# Altium schematic sheet Sheet1.SchDoc
size 420 x 297 mm; PageSetup: Record=PageOptions|CenterHorizontal=True|CenterVertical=True|PrintScale=1.00|XCorrection=1.00|YCorrection=1.00|PrintKind=1|BorderSize=5000000|LeftOffset=0|BottomOffset=0|Orientation=2|PaperLength=1000|PaperWidth=1000|Scale=100|PaperSource=15|PrintQuality=1200|MediaType=1|DitherType=10|PaperKind=A3|PrintScaleMode=1; Weight: -; ScaleFactor: -; NormInspection: Норм.Контр.; Name_1: Тележка с СЭС; Prepod: Лавров А.В.; Group: Группа ИУ4-83Б; Scale: 1:1; DocumentType: Схема электрическая принципиальная; FirstReferrence: АБВГ.123456.001; Number_kur: ИУ4.11.03.03.23.83.001 Э3
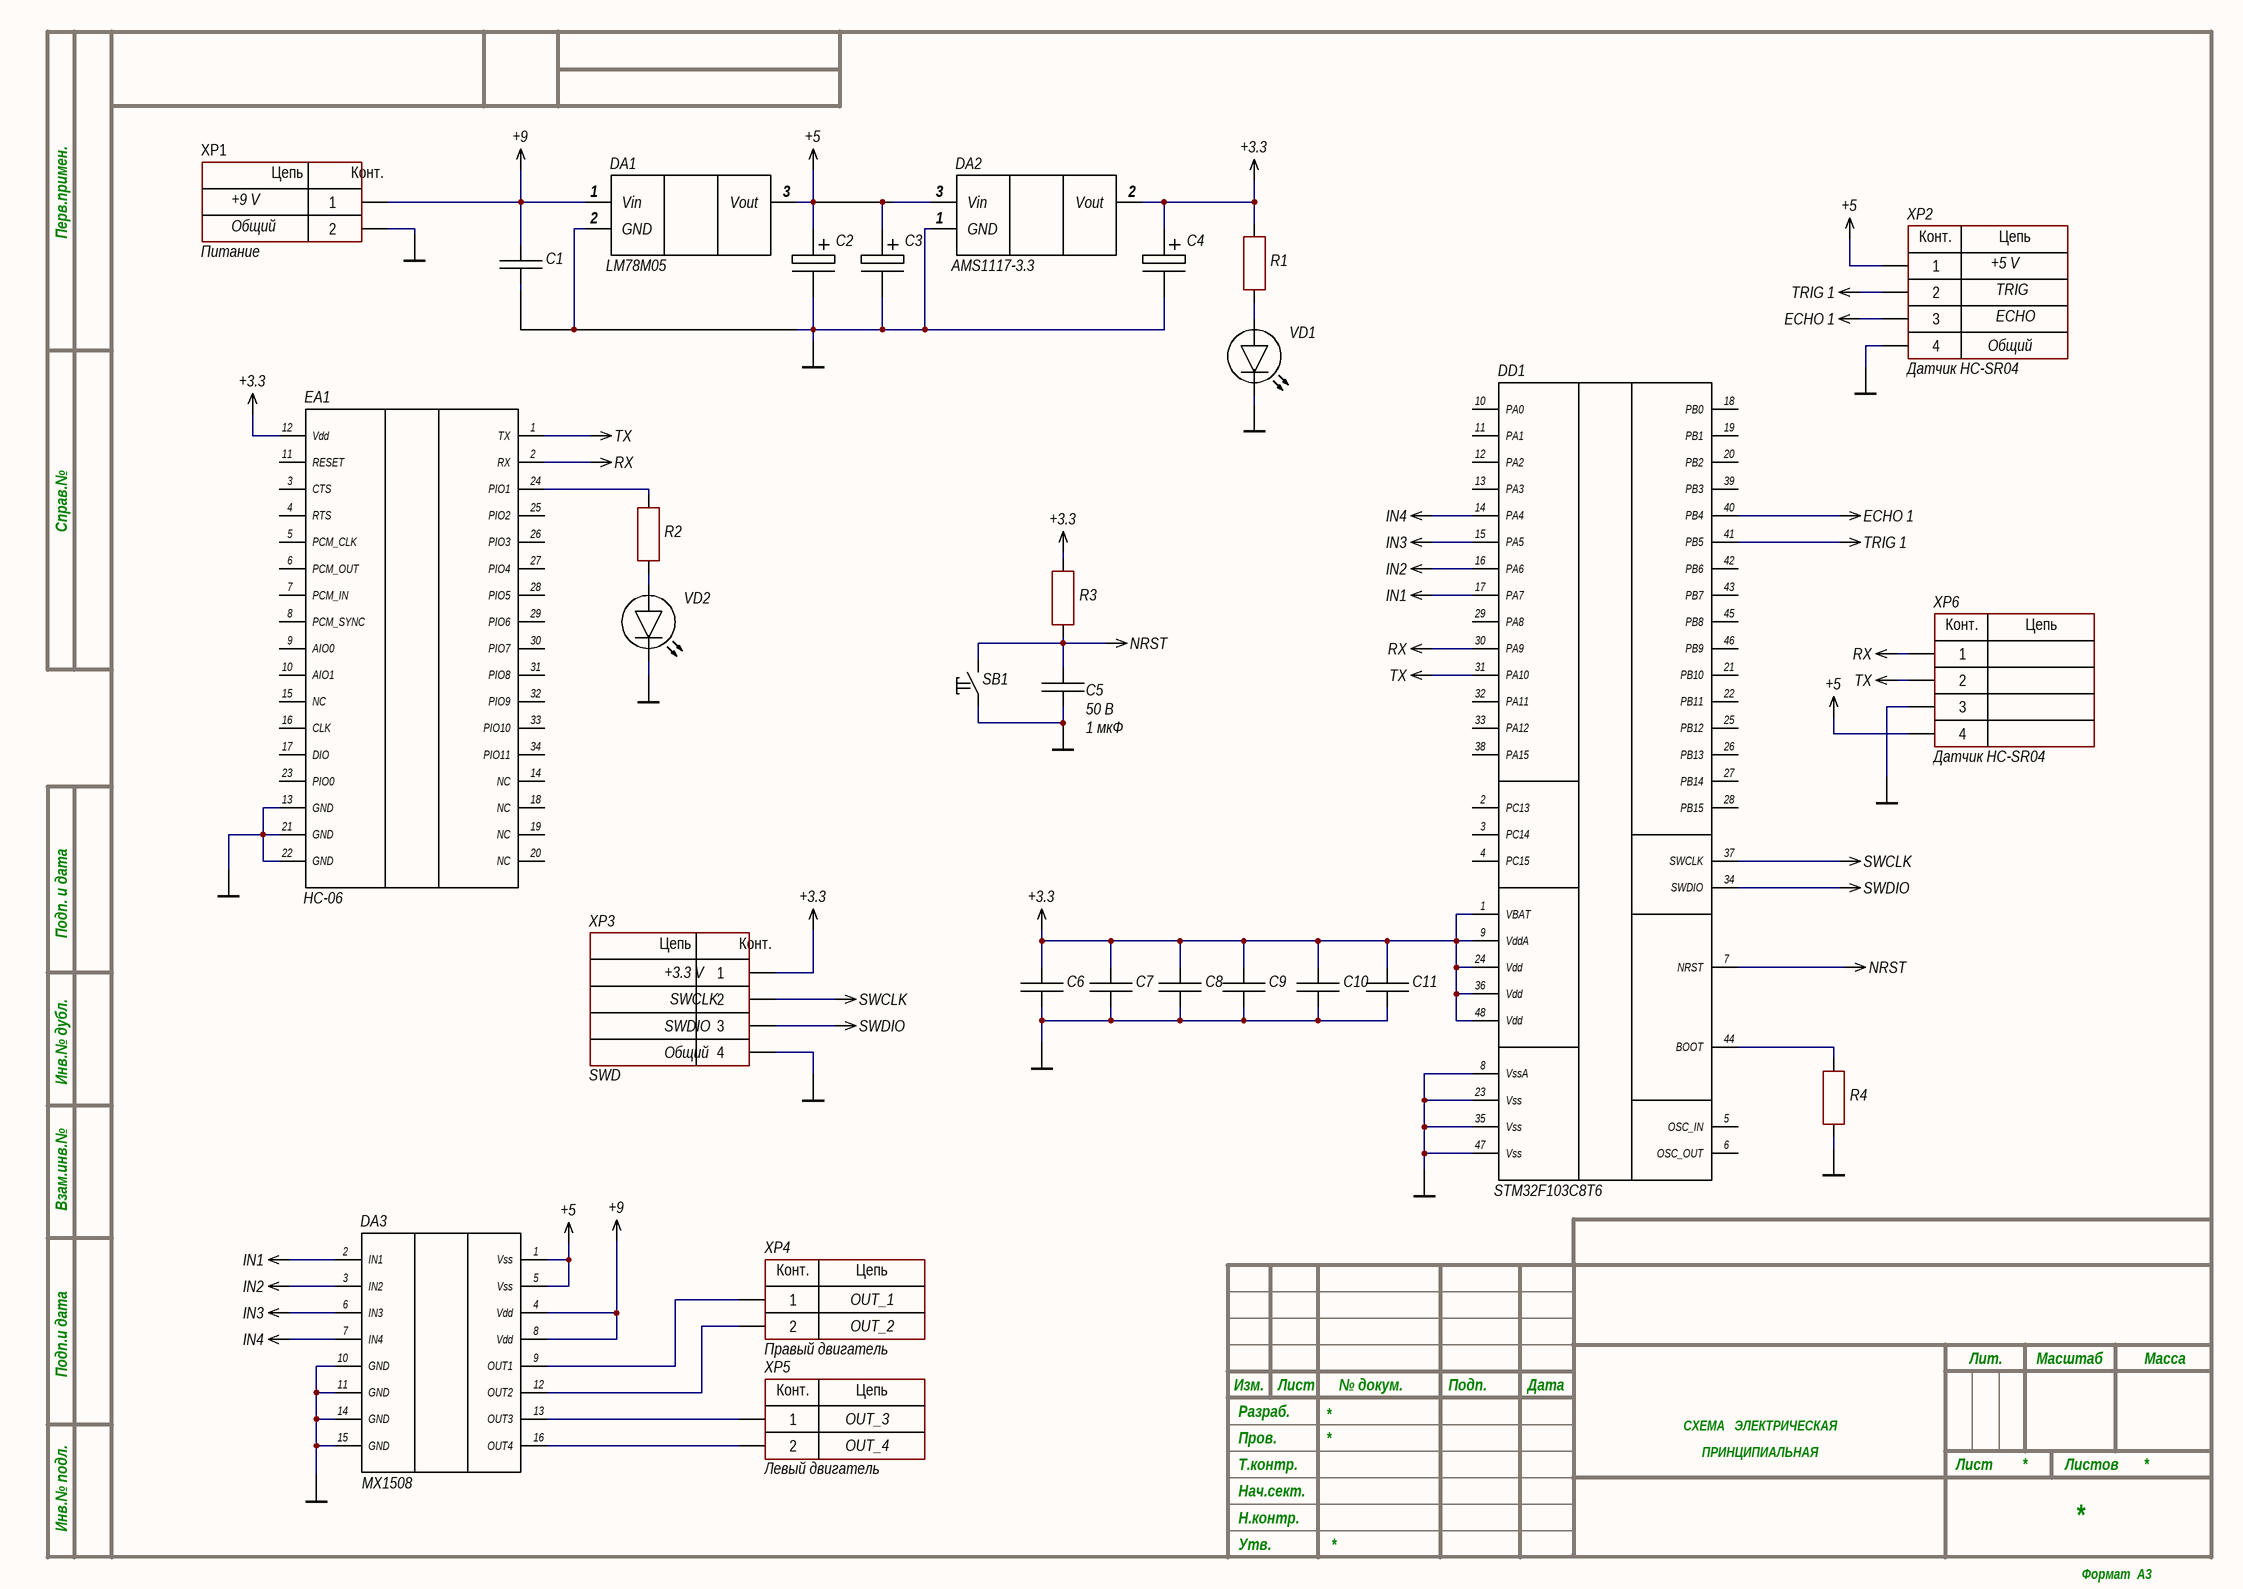
[diagram p0: Sheet1.SchDoc]

## Parts
C1  (no value)  [CAP: 0805]
C2  Cap_pol  [C0805]  (value not drawn)
C3  Cap_pol  [C0805]  (value not drawn)
C4  Cap_pol  [C0805]  (value not drawn)
C5  value 1 мкФ  Voltage: 50 В  [CAP: 0805]
C6  1uF  [CAP: 0805]  (value not drawn)
C7  (no value)  [CAP: 0805]
C8  (no value)  [CAP: 0805]
C9  (no value)  [CAP: 0805]
C10  (no value)  [CAP: 0805]
C11  (no value)  [CAP: 0805]
DA1  LM78M05  [TO252]
DA2  AMS1117-3.3  [SOT-223]
DA3  MX1508  [SO-16]
DD1  STM32F103C8T6  [LQFP-48]
EA1  HC-06  [HC-06]
R1  (no value)  [R0805]
R2  (no value)  [R0805]
R3  (no value)  [RES: 0805]
R4  (no value)  [R0805]
SB1  (no value)  [BUT: 6x6 SMD]
VD1  LED  [LD1206]  (value not drawn)
VD2  LED  [LD1206]  (value not drawn)
XP1  CommentText: Питание  [Conector 2.54]
XP2  CommentText: Датчик HC-SR04  [CON: PLS-4]
XP3  CommentText: SWD  [CON: PLS-4]
XP4  CommentText: Правый двигатель  [Conector 2.54]
XP5  CommentText: Левый двигатель  [Conector 2.54]
XP6  CommentText: Датчик HC-SR04  [CON: PLS-4]

## Nets
+3.3: C4.1 C6.2 C7.2 C8.2 C9.2 C10.2 C11.2 DA2.2 DD1.1(VBAT) DD1.9(VddA) DD1.24(Vdd) DD1.36(Vdd) DD1.48(Vdd) EA1.12(Vdd) R1.2 R3.2 XP3.1
+5: C2.1 C3.1 DA1.3 DA2.3 DA3.1(Vss) DA3.5(Vss) XP2.1 XP6.4
+9: C1.2 DA1.1 DA3.4(Vdd) DA3.8(Vdd) XP1.1
ECHO 1: DD1.40(PB4) XP2.3
GND: C1.1 C2.2 C3.2 C4.2 C5.1 C6.1 C7.1 C8.1 C9.1 C10.1 C11.1 DA1.2 DA2.1 DA3.10(GND) DA3.11(GND) DA3.14(GND) DA3.15(GND) DD1.8(VssA) DD1.23(Vss) DD1.35(Vss) DD1.47(Vss) EA1.13(GND) EA1.21(GND) EA1.22(GND) R4.1 SB1.1 VD1.2(K) VD2.2(K) XP1.2 XP2.4 XP3.4 XP6.3
IN1: DA3.2(IN1) DD1.17(PA7)
IN2: DA3.3(IN2) DD1.16(PA6)
IN3: DA3.6(IN3) DD1.15(PA5)
IN4: DA3.7(IN4) DD1.14(PA4)
NRST: C5.2 DD1.7(NRST) R3.1 SB1.2
RX: DD1.30(PA9) EA1.2(RX) XP6.1
SWCLK: DD1.37(SWCLK) XP3.2
SWDIO: DD1.34(SWDIO) XP3.3
TRIG 1: DD1.41(PB5) XP2.2
TX: DD1.31(PA10) EA1.1(TX) XP6.2
NetDA3_9: DA3.9(OUT1) XP4.1
NetDA3_12: DA3.12(OUT2) XP4.2
NetDA3_13: DA3.13(OUT3) XP5.1
NetDA3_16: DA3.16(OUT4) XP5.2
NetDD1_44: DD1.44(BOOT) R4.2
NetEA1_24: EA1.24(PIO1) R2.2
NetR1_1: R1.1 VD1.1(A)
NetR2_1: R2.1 VD2.1(A)

Not connected (* = marked no-connect by the designer): DD1 2(PC13) 3(PC14) 4(PC15) 5(OSC_IN) 6(OSC_OUT) 10(PA0) 11(PA1) 12(PA2) 13(PA3) 18(PB0) 19(PB1) 20(PB2) 21(PB10) 22(PB11) 25(PB12) 26(PB13) 27(PB14) 28(PB15) 29(PA8) 32(PA11) 33(PA12) 38(PA15) 39(PB3) 42(PB6) 43(PB7) 45(PB8) 46(PB9); EA1 3(CTS) 4(RTS) 5(PCM_CLK) 6(PCM_OUT) 7(PCM_IN) 8(PCM_SYNC) 9(AIO0) 10(AIO1) 11(RESET) 14(NC) 15(NC) 16(CLK) 17(DIO) 18(NC) 19(NC) 20(NC) 23(PIO0) 25(PIO2) 26(PIO3) 27(PIO4) 28(PIO5) 29(PIO6) 30(PIO7) 31(PIO8) 32(PIO9) 33(PIO10) 34(PIO11)

## Notes on the sheet
- Общий
- +9 V
- +5 V
- ECHO
- TRIG
- +3.3 V
- SWCLK
- SWDIO
- OUT_1
- OUT_2
- OUT_3
- OUT_4
- Перв.примен.
- Справ.№
- Подп. и дата
- Инв.№ дубл.
- Взам.инв.№
- Подп.и дата
- Разраб.
- Изм.
- Лист
- № докум.
- Подп.
- Дата
- Лит.
- Масштаб
- Масса
- Т.контр.
- Пров.
- СХЕМА   ЭЛЕКТРИЧЕСКАЯ
- ПРИНЦИПИАЛЬНАЯ
- Листов
- Инв.№ подл.
- Утв.
- Н.контр.
- Нач.сект.
- Формат  A3
- (in symbol AMS1117-3.3) Vin; Vout; GND
- (in symbol Connector_terminal_2pin) Цепь; Конт.
- (in symbol LM78M05) Vin; Vout; GND
- (in symbol PLS-4) Цепь; Конт.

## Library data of the parts
C1 = Ceramic_0805: 0.33uF; Manufacturer: Yageo; PartNumber: CC0805KRX7R7BB104; ValueManufacturerPartNumber: Ceramic capacitor, 0,33 мкФ, X7R, ±10%, 50 В, 0805, -55...+125°C; TypeCapacitor: Ceramic capacitor; Tolerance: ±10%; TypeDielectric: X7R; Voltage: 50 В; Value: 0,33 мкФ; Package: 0805; HelpURL: https://www.digikey.com/product-detail/en/yageo/CC0805KRX7R7BB104/311-1142-1-ND/303052; Temperature: -55...+125°C
C2 = Cap_pol: 0.1uF
C3 = Cap_pol: 0.1u
C4 = Cap_pol: 10uF
C5 = Ceramic_0805: 1uF; Manufacturer: Yageo; PartNumber: CC0805KRX7R7BB104; ValueManufacturerPartNumber: Ceramic capacitor, 1 мкФ, X7R, ±10%, 50 В, 0805, -55...+125°C; TypeCapacitor: Ceramic capacitor; Tolerance: ±10%; TypeDielectric: X7R; Package: 0805; HelpURL: https://www.digikey.com/product-detail/en/yageo/CC0805KRX7R7BB104/311-1142-1-ND/303052; Temperature: -55...+125°C
C6 = Ceramic_0805: Manufacturer: Yageo; PartNumber: CC0805KRX7R7BB104; ValueManufacturerPartNumber: Ceramic capacitor, 100 нФ, X7R, ±10%, 50 В, 0805, -55...+125°C; TypeCapacitor: Ceramic capacitor; Tolerance: ±10%; TypeDielectric: X7R; Voltage: 50 В; Value: 100 нФ; Package: 0805; HelpURL: https://www.digikey.com/product-detail/en/yageo/CC0805KRX7R7BB104/311-1142-1-ND/303052; Temperature: -55...+125°C
C7-C10 = Ceramic_0805: 100nF; Manufacturer: Yageo; PartNumber: CC0805KRX7R7BB104; ValueManufacturerPartNumber: Ceramic capacitor, 100 нФ, X7R, ±10%, 50 В, 0805, -55...+125°C; TypeCapacitor: Ceramic capacitor; Tolerance: ±10%; TypeDielectric: X7R; Voltage: 50 В; Value: 100 нФ; Package: 0805; HelpURL: https://www.digikey.com/product-detail/en/yageo/CC0805KRX7R7BB104/311-1142-1-ND/303052; Temperature: -55...+125°C
C11 = Ceramic_0805: 10uF; Manufacturer: Yageo; PartNumber: CC0805KRX7R7BB104; ValueManufacturerPartNumber: Ceramic capacitor, 100 нФ, X7R, ±10%, 50 В, 0805, -55...+125°C; TypeCapacitor: Ceramic capacitor; Tolerance: ±10%; TypeDielectric: X7R; Voltage: 50 В; Value: 100 нФ; Package: 0805; HelpURL: https://www.digikey.com/product-detail/en/yageo/CC0805KRX7R7BB104/311-1142-1-ND/303052; Temperature: -55...+125°C
DD1 = STM32
R1-R4 = Resistor_0805: Manufacturer: Yageo; PartNumber: RC0805JR-07100RL; ValueManufacturerPartNumber: Resistor film, 4,7 кОм, ±1%, 0805, 0.125W, -55...+125°C; TypeResistor: Resistor film; Power: 0.125W; Tolerance: ±1%; Value: 4,7 кОм; Package: 0805; HelpURL: https://www.digikey.com/product-detail/en/yageo/RC0805JR-07100RL/311-100ARCT-ND/731185; Temperature: -55...+125°C
SB1 = Button_tactile: Manufacturer: TE Connectivity; ValueManufacturerPartNumber: Tactile button, 6x6mm; PartNumber: FSM2JSMAATR; TypeButton: Tactile button; CommentText: "Кнопка"; HelpURL: https://www.digikey.com/product-detail/en/te-connectivity-alcoswitch-switches/FSM2JSMAATR/450-1792-1-ND/3503931; Package: 6x6mm
XP1 XP4 XP5 = Connector_terminal_2pin: Manufacturer: Degson; ValueManufacturerPartNumber: Terminal connector, 2pin, 3.5mm, 300VAC, 10A; PartNumber: DG350-3.5-02P-14; TypeConnector: Terminal connector; VoltageMax: 300VAC; Pitch: 3.5mm; CurrentMax: 10A; Multichannel: 2pin; HelpURL: https://www.chipdip.ru/product/dg350-3.5-02p-12
XP2 XP3 XP6 = PLS-4: Manufacturer: Connfly; ValueManufacturerPartNumber: Connector, 4pin, 2.54mm, 500VAC, 3A; TypeConnector: Connector; VoltageMax: 500VAC; Pitch: 2.54mm; CurrentMax: 3A; Multichannel: 4pin; HelpURL: https://www.chipdip.ru/product/pls-4; PartNumber: PLS-4